# EAGLE design 2x4_test_r1 (EAGLE 5.10)
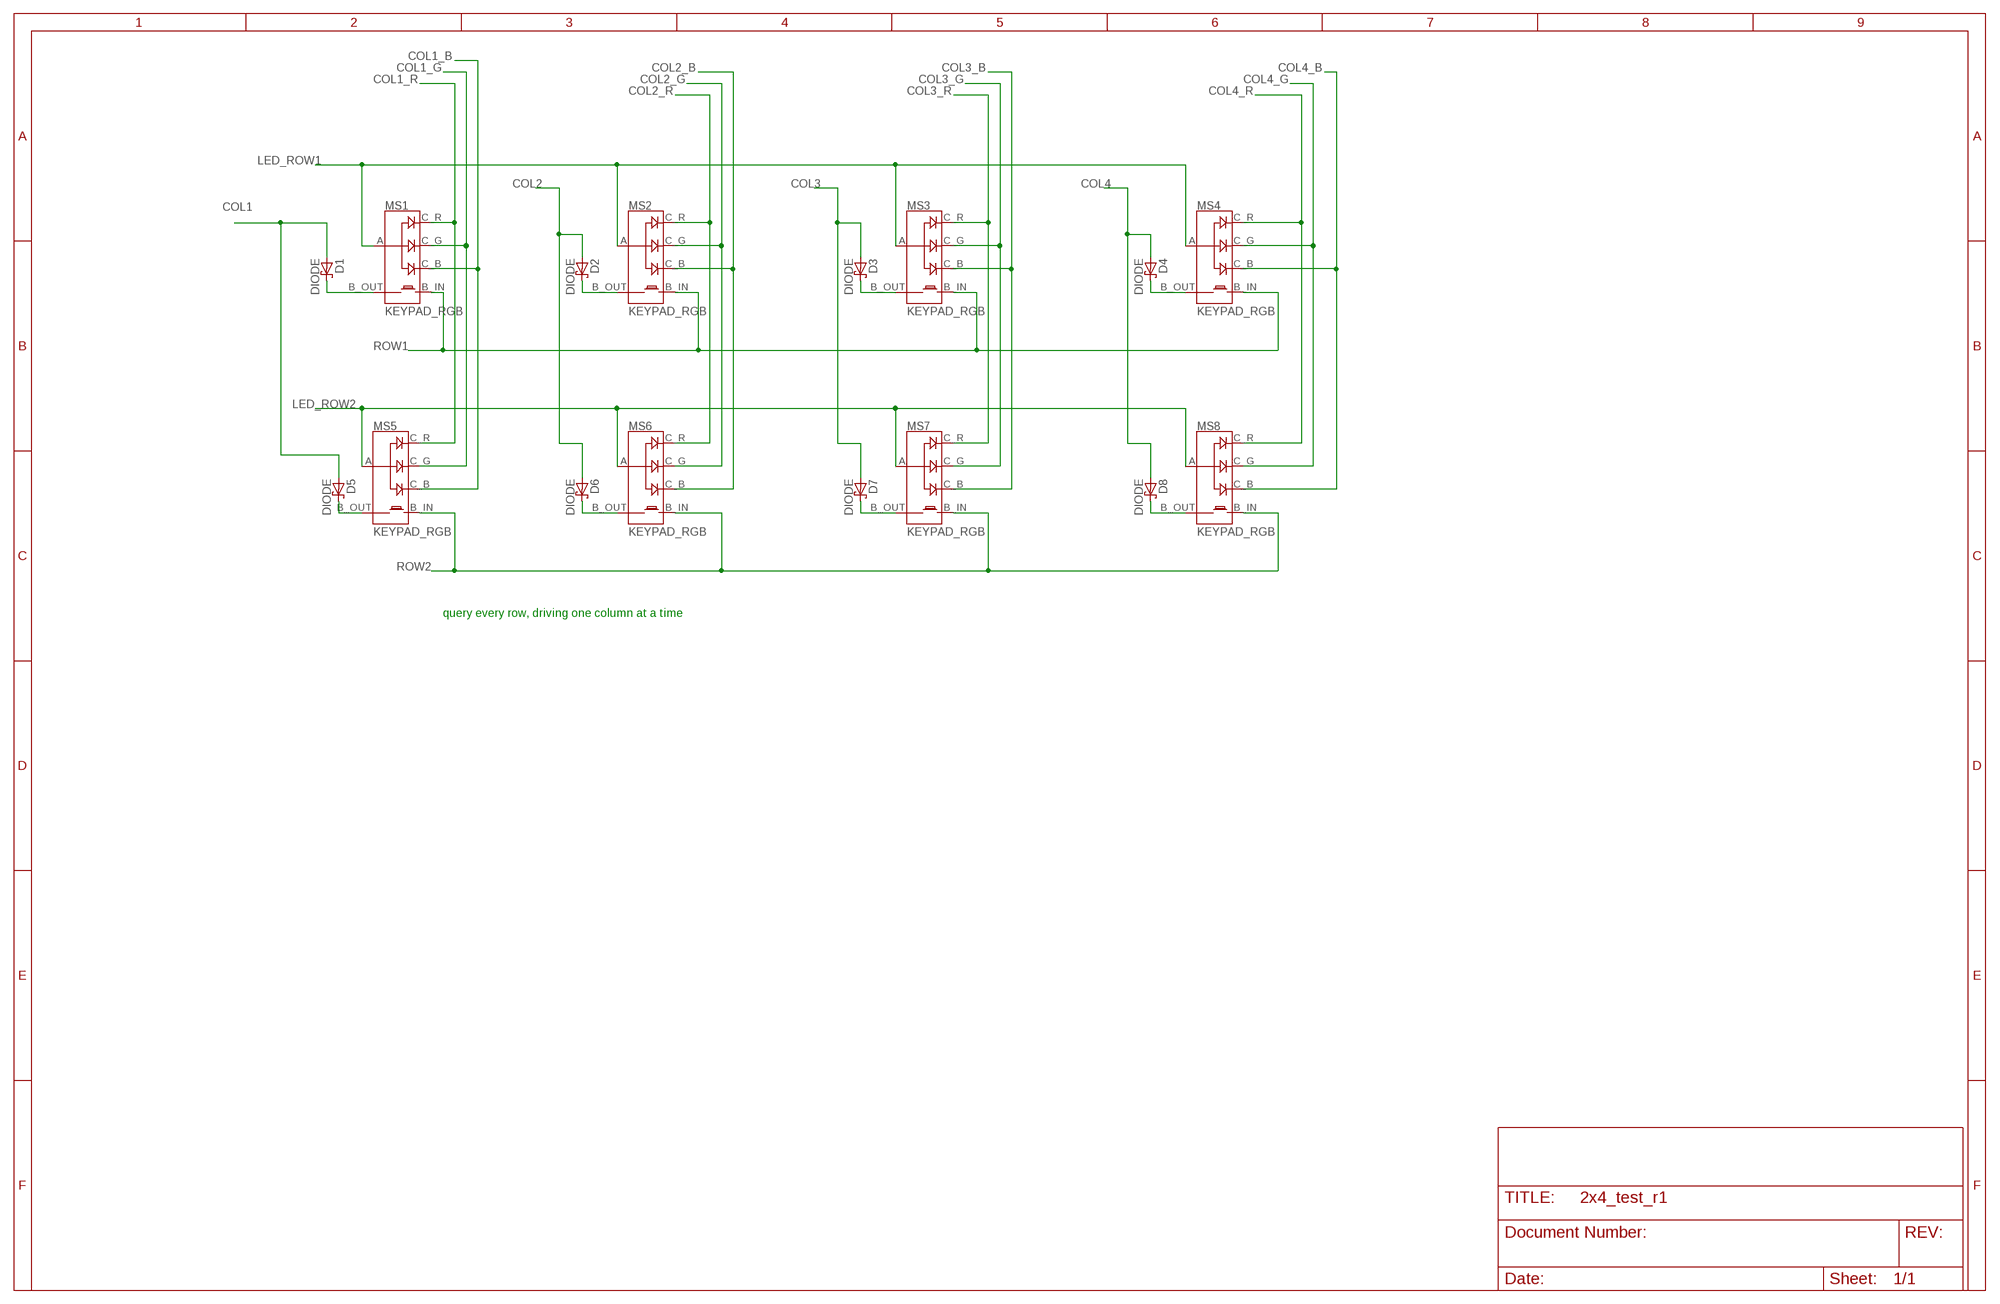
[diagram p0: schematic, sheet 1]

## Parts
D1  DIODE  [SOD123]
D2  DIODE  [SOD123]
D3  DIODE  [SOD123]
D4  DIODE  [SOD123]
D5  DIODE  [SOD123]
D6  DIODE  [SOD123]
D7  DIODE  [SOD123]
D8  DIODE  [SOD123]
MS1  KEYPAD_RGB  [KEYPAD-RGB]
MS2  KEYPAD_RGB  [KEYPAD-RGB]
MS3  KEYPAD_RGB  [KEYPAD-RGB]
MS4  KEYPAD_RGB  [KEYPAD-RGB]
MS5  KEYPAD_RGB  [KEYPAD-RGB]
MS6  KEYPAD_RGB  [KEYPAD-RGB]
MS7  KEYPAD_RGB  [KEYPAD-RGB]
MS8  KEYPAD_RGB  [KEYPAD-RGB]

## Nets
COL1: D1.A D5.A
COL1_B: MS1.C_B(BLUE) MS5.C_B(BLUE)
COL1_G: MS1.C_G(GREEN) MS5.C_G(GREEN)
COL1_R: MS1.C_R(RED) MS5.C_R(RED)
COL2: D2.A D6.A
COL2_B: MS2.C_B(BLUE) MS6.C_B(BLUE)
COL2_G: MS2.C_G(GREEN) MS6.C_G(GREEN)
COL2_R: MS2.C_R(RED) MS6.C_R(RED)
COL3: D3.A D7.A
COL3_B: MS3.C_B(BLUE) MS7.C_B(BLUE)
COL3_G: MS3.C_G(GREEN) MS7.C_G(GREEN)
COL3_R: MS3.C_R(RED) MS7.C_R(RED)
COL4: D4.A D8.A
COL4_B: MS4.C_B(BLUE) MS8.C_B(BLUE)
COL4_G: MS4.C_G(GREEN) MS8.C_G(GREEN)
COL4_R: MS4.C_R(RED) MS8.C_R(RED)
LED_ROW1: MS1.A(ANODE) MS2.A(ANODE) MS3.A(ANODE) MS4.A(ANODE)
LED_ROW2: MS5.A(ANODE) MS6.A(ANODE) MS7.A(ANODE) MS8.A(ANODE)
N$2: D2.C MS2.B_OUT(BTN_0)
N$3: D1.C MS1.B_OUT(BTN_0)
N$5: D3.C MS3.B_OUT(BTN_0)
N$8: D4.C MS4.B_OUT(BTN_0)
N$13: D8.C MS8.B_OUT(BTN_0)
N$14: D7.C MS7.B_OUT(BTN_0)
N$15: D6.C MS6.B_OUT(BTN_0)
N$16: D5.C MS5.B_OUT(BTN_0)
ROW1: MS1.B_IN(BTN_1) MS2.B_IN(BTN_1) MS3.B_IN(BTN_1) MS4.B_IN(BTN_1)
ROW2: MS5.B_IN(BTN_1) MS6.B_IN(BTN_1) MS7.B_IN(BTN_1) MS8.B_IN(BTN_1)

## Notes on the sheet
- query every row, driving one column at a time

## Library data of the parts
D1-D8 = monome:DIODE
MS1-MS8 = mnm_rgb:KEYPAD_RGB

## Board
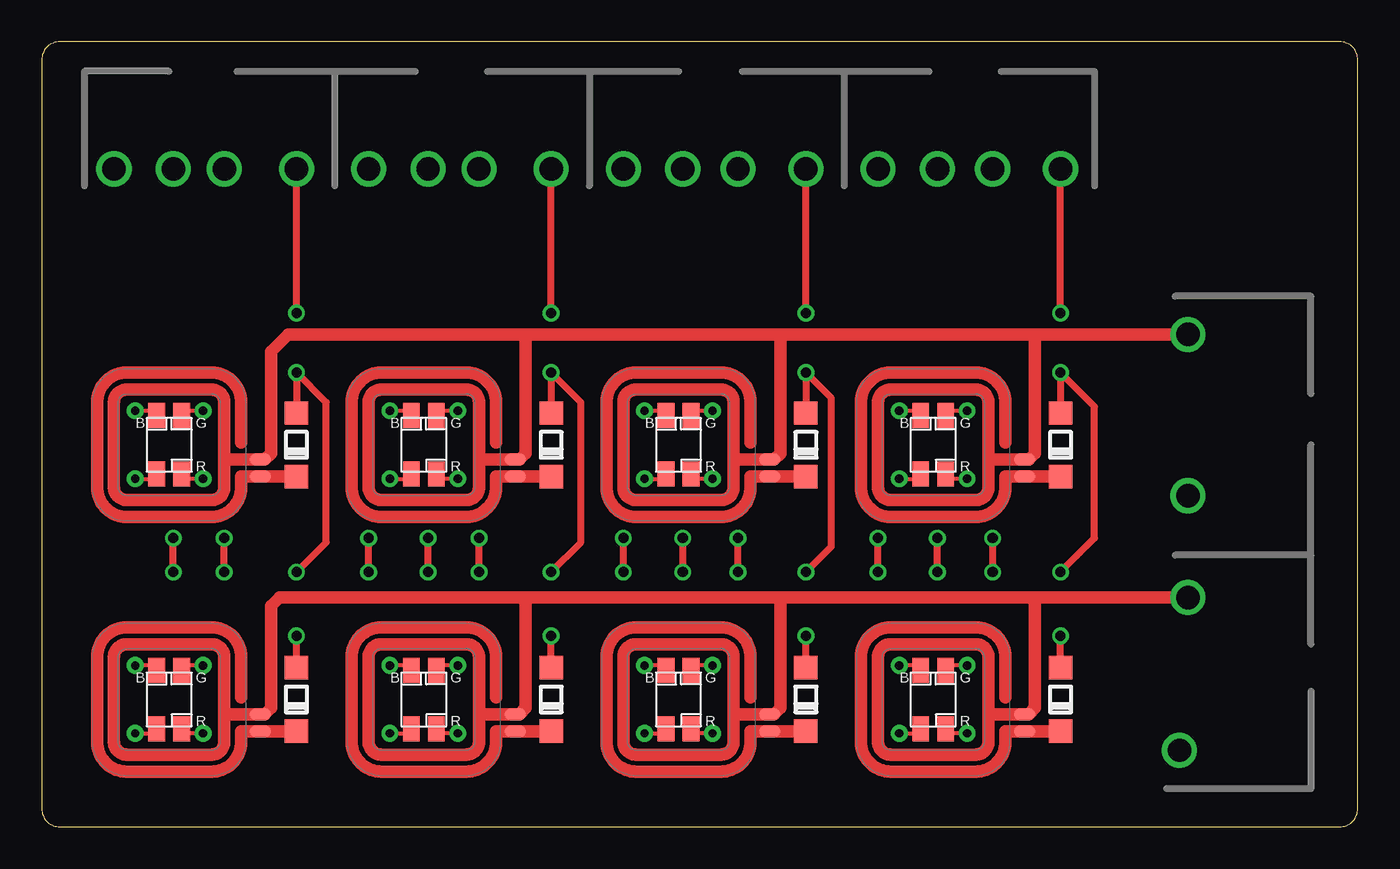
[diagram p1: board, top side]
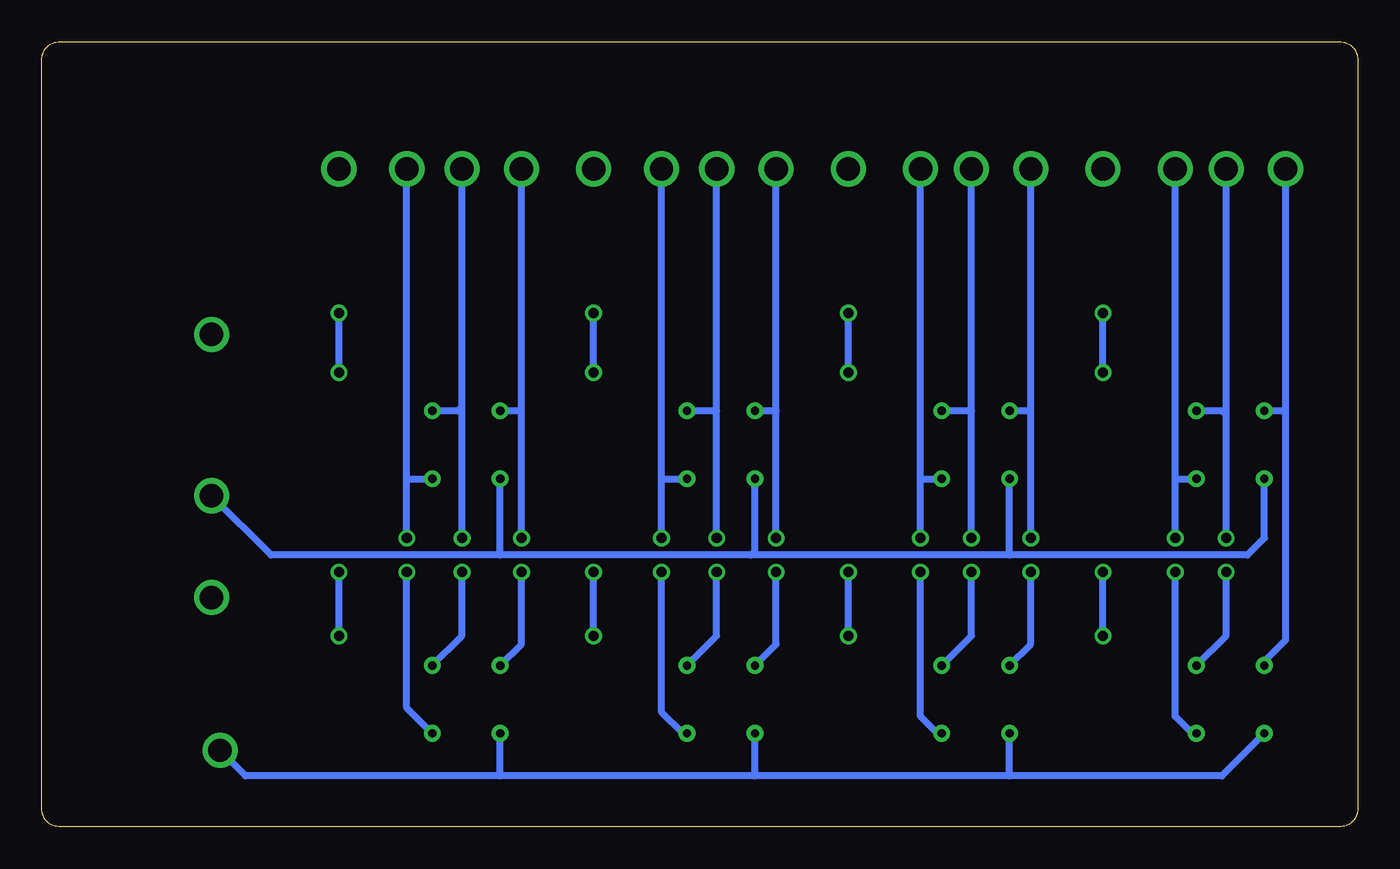
[diagram p2: board, bottom side, seen from below]

Size 78.74 x 46.98 mm. Coordinates in mm from the lower left corner, seen from the top.
Outline: 77.66,0 arc90 78.74,1.08 78.74,45.91 arc90 77.67,46.98 1.07,46.98 arc90 0,45.91 0,1.08 arc90 1.08,0 77.66,0
Copper layers (1*16): Top 0.035mm / dielectric 1.5mm / Bottom 0.035mm
Design rules "default": minimum track width 10mil, minimum drill 24mil, track to track 8mil, track to pad 8mil, pad to pad 8mil, via to via 8mil, smd to smd 8mil, copper to edge 40mil, drill to drill 8mil, minimum pad ring 10mil, minimum via ring 8mil, stop-mask expansion 4mil, vias tented up to drill 0mil, thermal gap 10mil

### Footprints (pad centres in the part's own frame; a part is rotated, then mirrored left to right if it is on the bottom)
SOD123 = smd 1.4 x 1.4: A 1.9,0; C -1.9,0
KEYPAD-RGB = drill 0.5 round: A -2.032,-2.032; C_B -2.032,2.032; C_G 2.032,2.032; C_R 2.032,-2.032 | smd 1 x 1.5: A_SMD -0.75,-1.75; C_B_SMD -0.75,1.75; C_G_SMD 0.75,1.75; C_R_SMD 0.75,-1.75 | smd 1.27 x 0.762: B_IN 5.461,-0.889; B_OUT 5.461,-1.905

### Placement (x,y rotation side)
D1  15.24,7.62 90 top
D2  30.48,7.62 90 top
D3  45.72,7.62 90 top
D4  60.96,7.62 90 top
D5  15.24,22.86 90 top
D6  30.48,22.86 90 top
D7  45.72,22.86 90 top
D8  60.96,22.86 90 top
MS1  7.62,7.62 0 top
MS2  22.86,7.62 0 top
MS3  38.1,7.62 0 top
MS4  53.34,7.62 0 top
MS5  7.62,22.86 0 top
MS6  22.86,22.86 0 top
MS7  38.1,22.86 0 top
MS8  53.34,22.86 0 top

### Tracks (layer width: path | path; a pad name or v marks a point on that pad's centre or on a via)
COL1  (via drill 0.6, 1.4)
  Top 0.406: D1.A v15.24,11.43 | D5.A v15.24,27.18 17.02,25.4 17.02,17.02 v15.24,15.24 | v15.24,30.73 v15.24,39.37
  Bottom 0.406: v15.24,11.43 v15.24,15.24 | v15.24,27.18 v15.24,30.73
COL1_B  (via drill 1.4)
  Bottom 0.406: MS1.C_B 5.59,9.91 4.32,11.18 4.32,24.89 | 4.32,24.89 MS5.C_B | 4.32,24.89 v4.32,39.37
COL1_G  (via drill 0.6, 1.4)
  Top 0.406: v7.87,15.24 v7.87,17.27
  Bottom 0.406: MS1.C_G 7.87,11.43 v7.87,15.24 | v7.87,17.27 7.87,24.64 | MS5.C_G 8.13,24.89 7.87,24.64 | 7.87,24.64 v7.87,39.37
COL1_R  (via drill 0.6, 1.4)
  Top 0.406: v10.92,15.24 v10.92,17.27
  Bottom 0.406: MS1.C_R 9.91,5.59 10.92,6.6 v10.92,15.24 | v10.92,17.27 10.92,20.83 | 10.92,20.83 MS5.C_R | 10.92,20.83 v10.92,39.37
COL2  (via drill 0.6, 1.4)
  Top 0.406: D6.A v30.48,27.18 32.26,25.4 32.26,17.02 v30.48,15.24 | D2.A v30.48,11.43 | v30.48,30.73 v30.48,39.37
  Bottom 0.406: v30.48,27.18 v30.48,30.73 | v30.48,11.43 v30.48,15.24
COL2_B  (via drill 0.6, 1.4)
  Top 0.406: v19.56,15.24 v19.56,17.27
  Bottom 0.406: MS2.C_B 19.56,10.92 v19.56,15.24 | 19.56,24.89 MS6.C_B | v19.56,17.27 19.56,24.89 | 19.56,24.89 v19.56,39.37
COL2_G  (via drill 0.6, 1.4)
  Top 0.406: v23.11,15.24 v23.11,17.27
  Bottom 0.406: MS2.C_G 23.11,11.43 v23.11,15.24 | v23.11,17.27 23.11,24.89 | 23.11,24.89 MS6.C_G | 23.11,24.89 v23.11,39.37
COL2_R  (via drill 0.6, 1.4)
  Top 0.406: v26.16,15.24 v26.16,17.27
  Bottom 0.406: MS2.C_R 25.15,5.59 26.16,6.6 v26.16,15.24 | v26.16,17.27 26.16,20.83 | 26.16,20.83 MS6.C_R | 26.16,20.83 v26.16,39.37
COL3  (via drill 0.6, 1.4)
  Top 0.406: D7.A v45.72,27.18 47.24,25.65 47.24,16.76 v45.72,15.24 | D3.A v45.72,11.43 | v45.72,30.73 v45.72,39.37
  Bottom 0.406: v45.72,27.18 v45.72,30.73 | v45.72,11.43 v45.72,15.24
COL3_B  (via drill 0.6, 1.4)
  Top 0.406: v34.8,15.24 v34.8,17.27
  Bottom 0.406: MS3.C_B 34.8,10.92 v34.8,15.24 | v34.8,17.27 34.8,24.89 | 34.8,24.89 MS7.C_B | 34.8,24.89 v34.8,39.37
COL3_G  (via drill 0.6, 1.4)
  Top 0.406: v38.35,15.24 v38.35,17.27
  Bottom 0.406: MS3.C_G 38.35,11.43 v38.35,15.24 | v38.35,17.27 38.35,24.89 | 38.35,24.89 MS7.C_G | 38.35,24.89 v38.35,39.37
COL3_R  (via drill 0.6, 1.4)
  Top 0.406: v41.66,15.24 v41.66,17.27
  Bottom 0.406: MS3.C_R 40.39,5.59 41.66,6.86 v41.66,15.24 | v41.66,17.27 41.66,20.83 | 41.66,20.83 MS7.C_R | 41.66,20.83 v41.66,39.37
COL4  (via drill 0.6, 1.4)
  Top 0.406: D8.A v60.96,27.18 62.99,25.15 62.99,17.27 v60.96,15.24 | D4.A v60.96,11.43 | v60.96,30.73 v60.96,39.37
  Bottom 0.406: v60.96,27.18 v60.96,30.73 | v60.96,11.43 v60.96,15.24
COL4_B  (via drill 0.6, 1.4)
  Top 0.406: v50.04,15.24 v50.04,17.27
  Bottom 0.406: MS4.C_B 50.04,10.92 v50.04,15.24 | v50.04,17.27 50.04,24.89 | 50.04,24.89 MS8.C_B | 50.04,24.89 v50.04,39.37
COL4_G  (via drill 0.6, 1.4)
  Top 0.406: v53.59,15.24 v53.59,17.27
  Bottom 0.406: MS4.C_G 53.59,11.43 v53.59,15.24 | v53.59,17.27 53.59,25.15 | MS8.C_G 53.85,24.89 53.59,25.15 | 53.59,25.15 v53.59,39.37
COL4_R  (via drill 0.6, 1.4)
  Top 0.406: v56.9,15.24 v56.9,17.27
  Bottom 0.406: MS4.C_R 56.9,7.11 v56.9,15.24 | v56.9,17.27 56.9,20.83 | 56.9,20.83 MS8.C_R | 56.9,20.83 v56.9,39.37
LED_ROW1  (via drill 1.4)
  Bottom 0.406: 20.83,3.05 8.13,3.05 MS1.A | 20.83,3.05 36.07,3.05 | 36.07,3.05 51.31,3.05 | 51.31,3.05 66.55,3.05 v68.07,4.57 | 20.83,3.05 MS2.A | 36.07,3.05 MS3.A | 51.31,3.05 MS4.A
LED_ROW2  (via drill 1.4)
  Bottom 0.406: MS5.A 5.59,17.27 6.6,16.26 20.83,16.26 | 20.83,16.26 36.32,16.26 | 36.32,16.26 51.31,16.26 | 20.83,16.26 MS6.A | MS7.A 36.07,16.51 36.32,16.26 | 51.31,16.26 MS8.A | 51.31,16.26 65.02,16.26 v68.58,19.81
N$2
  Top 0.762: MS2.B_OUT D2.C
N$3
  Top 0.762: MS1.B_OUT D1.C
N$5
  Top 0.762: MS3.B_OUT D3.C
N$8
  Top 0.762: MS4.B_OUT D4.C
N$13
  Top 0.762: MS8.B_OUT D8.C
N$14
  Top 0.762: MS7.B_OUT D7.C
N$15
  Top 0.762: MS6.B_OUT D6.C
N$16
  Top 0.762: MS5.B_OUT D5.C
ROW1  (via drill 1.4)
  Top 0.762: 28.7,13.72 14.22,13.72 13.72,13.21 13.72,7.11 13.34,6.73 MS1.B_IN | 28.7,13.72 44.2,13.72 | 44.2,13.72 59.18,13.72 | MS2.B_IN 28.57,6.73 28.96,7.11 28.96,13.46 28.7,13.72 | MS3.B_IN 43.81,6.73 44.2,7.11 44.2,13.72 | MS4.B_IN 59.05,6.73 59.44,7.11 59.44,13.46 59.18,13.72 | 59.18,13.72 v68.58,13.72
ROW2  (via drill 1.4)
  Top 0.762: MS5.B_IN 13.34,21.97 13.72,22.35 13.72,28.45 14.73,29.46 28.96,29.46 | 28.96,29.46 43.94,29.46 | 43.94,29.46 59.44,29.46 | MS6.B_IN 28.57,21.97 28.96,22.35 28.96,29.46 | MS7.B_IN 43.81,21.97 44.2,22.35 44.2,29.21 43.94,29.46 | MS8.B_IN 59.05,21.97 59.44,22.35 59.44,29.46 | 59.44,29.46 v68.58,29.46

### Text on the board
tDocu: C1 | C2 | C3 | C4 | RGB test | B | G | R | B | G | R | B | G | R | B | G | R | matrix | Rev 1 | Dec 2010 | R1 | anode | R2 | anode